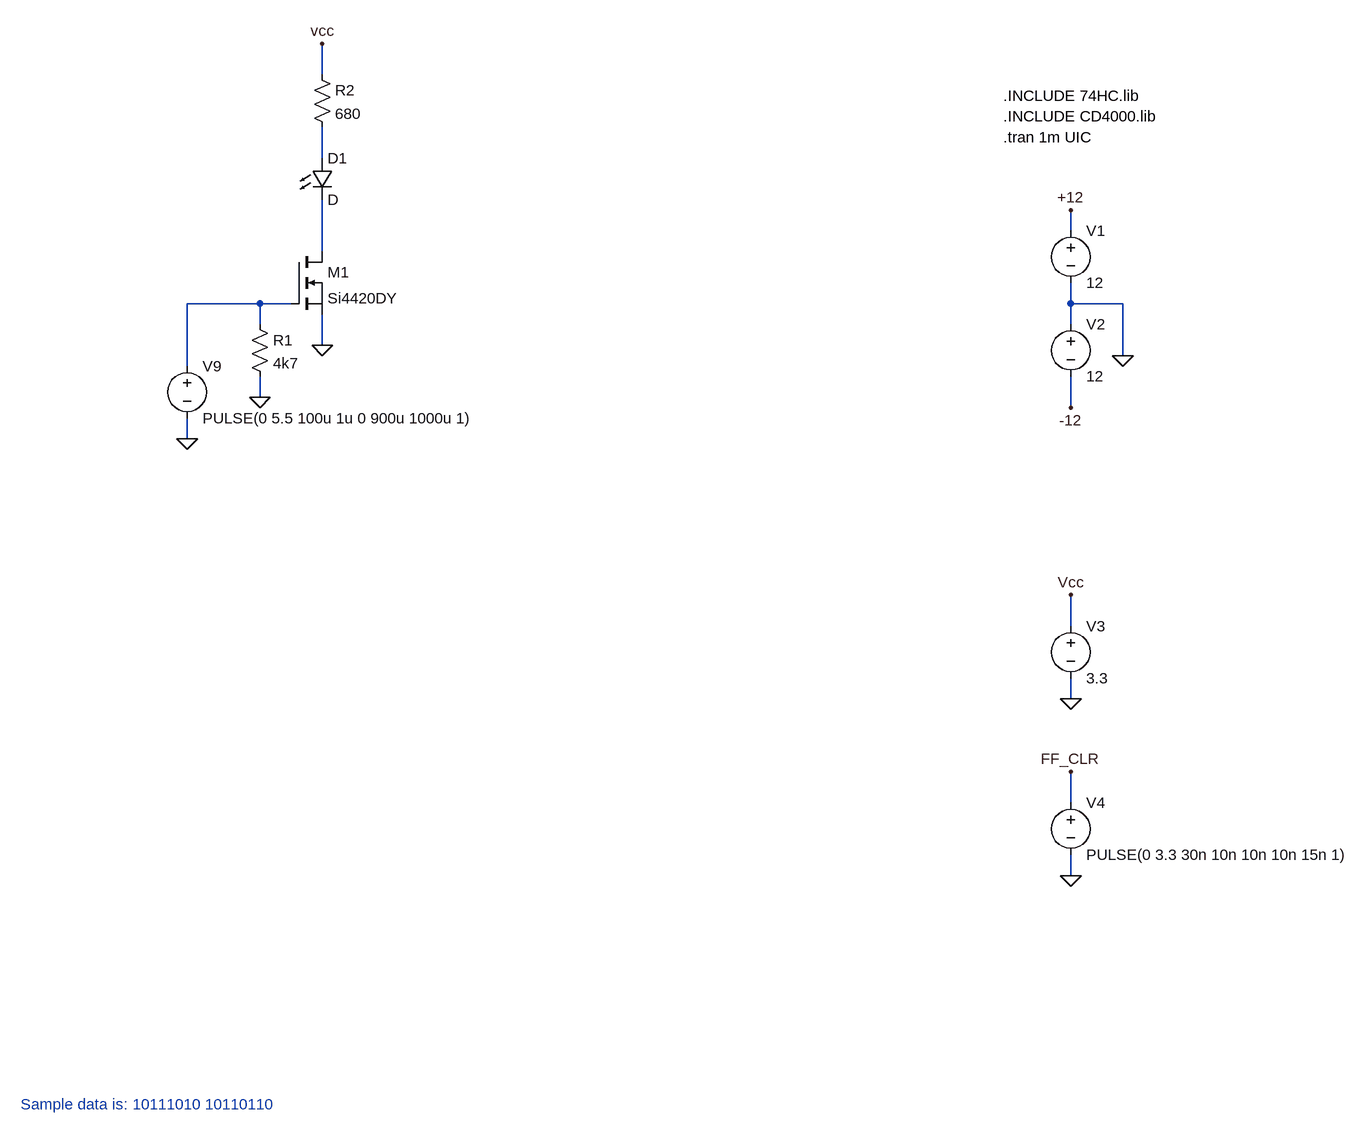
[diagram p0: schematic PG_sim.asc]
PG_sim.asc, the LTspice schematic file:
Version 4
SHEET 1 3368 3520
WIRE -1088 16 -1088 -32
WIRE -1088 144 -1088 96
WIRE 64 256 64 224
WIRE -1088 288 -1088 208
WIRE -1184 368 -1296 368
WIRE -1136 368 -1184 368
WIRE 64 368 64 336
WIRE 144 368 64 368
WIRE -1184 400 -1184 368
WIRE 64 400 64 368
WIRE -1088 432 -1088 384
WIRE 144 448 144 368
WIRE -1296 464 -1296 368
WIRE -1184 512 -1184 480
WIRE 64 528 64 480
WIRE -1296 576 -1296 544
WIRE 64 864 64 816
WIRE 64 976 64 944
WIRE 64 1136 64 1088
WIRE 64 1248 64 1216
FLAG 64 224 +12
FLAG 64 528 -12
FLAG 144 448 0
FLAG 64 816 Vcc
FLAG 64 976 0
FLAG 64 1088 FF_CLR
FLAG 64 1248 0
FLAG -1296 576 0
FLAG -1184 512 0
FLAG -1088 432 0
FLAG -1088 -32 vcc
SYMBOL voltage 64 240 R0
SYMATTR InstName V1
SYMATTR Value 12
SYMBOL voltage 64 384 R0
SYMATTR InstName V2
SYMATTR Value 12
SYMBOL voltage 64 848 R0
SYMATTR InstName V3
SYMATTR Value 3.3
SYMBOL voltage 64 1120 R0
SYMATTR InstName V4
SYMATTR Value PULSE(0 3.3 30n 10n 10n 10n 15n 1)
SYMBOL voltage -1296 448 R0
SYMATTR InstName V9
SYMATTR Value PULSE(0 5.5 100u 1u 0 900u 1000u 1)
SYMBOL nmos -1136 288 R0
SYMATTR InstName M1
SYMATTR Value Si4420DY
SYMBOL res -1200 384 R0
SYMATTR InstName R1
SYMATTR Value 4k7
SYMBOL res -1104 0 R0
SYMATTR InstName R2
SYMATTR Value 680
SYMBOL LED -1104 144 R0
SYMATTR InstName D1
TEXT -40 112 Left 2 !.tran 1m UIC
TEXT -40 80 Left 2 !.INCLUDE CD4000.lib
TEXT -40 48 Left 2 !.INCLUDE 74HC.lib
TEXT -1552 1600 Left 2 ;Sample data is: 10111010 10110110

The netlist it stands for:
* PG_sim.asc
V1 +12 0 12
V2 0 -12 12
V3 Vcc 0 3.3
V4 FF_CLR 0 PULSE(0 3.3 30n 10n 10n 10n 15n 1)
V9 N003 0 PULSE(0 5.5 100u 1u 0 900u 1000u 1)
M1 N002 N003 0 0 Si4420DY
R1 N003 0 4k7
R2 Vcc N001 680
D1 N001 N002 D
.model D D
.lib standard.dio
.model NMOS NMOS
.model PMOS PMOS
.lib standard.mos
.tran 1m UIC
.INCLUDE CD4000.lib
.INCLUDE 74HC.lib
* Sample data is: 10111010 10110110
.backanno
.end